# Altium schematic sheet Sheet5.SchDoc
size A4
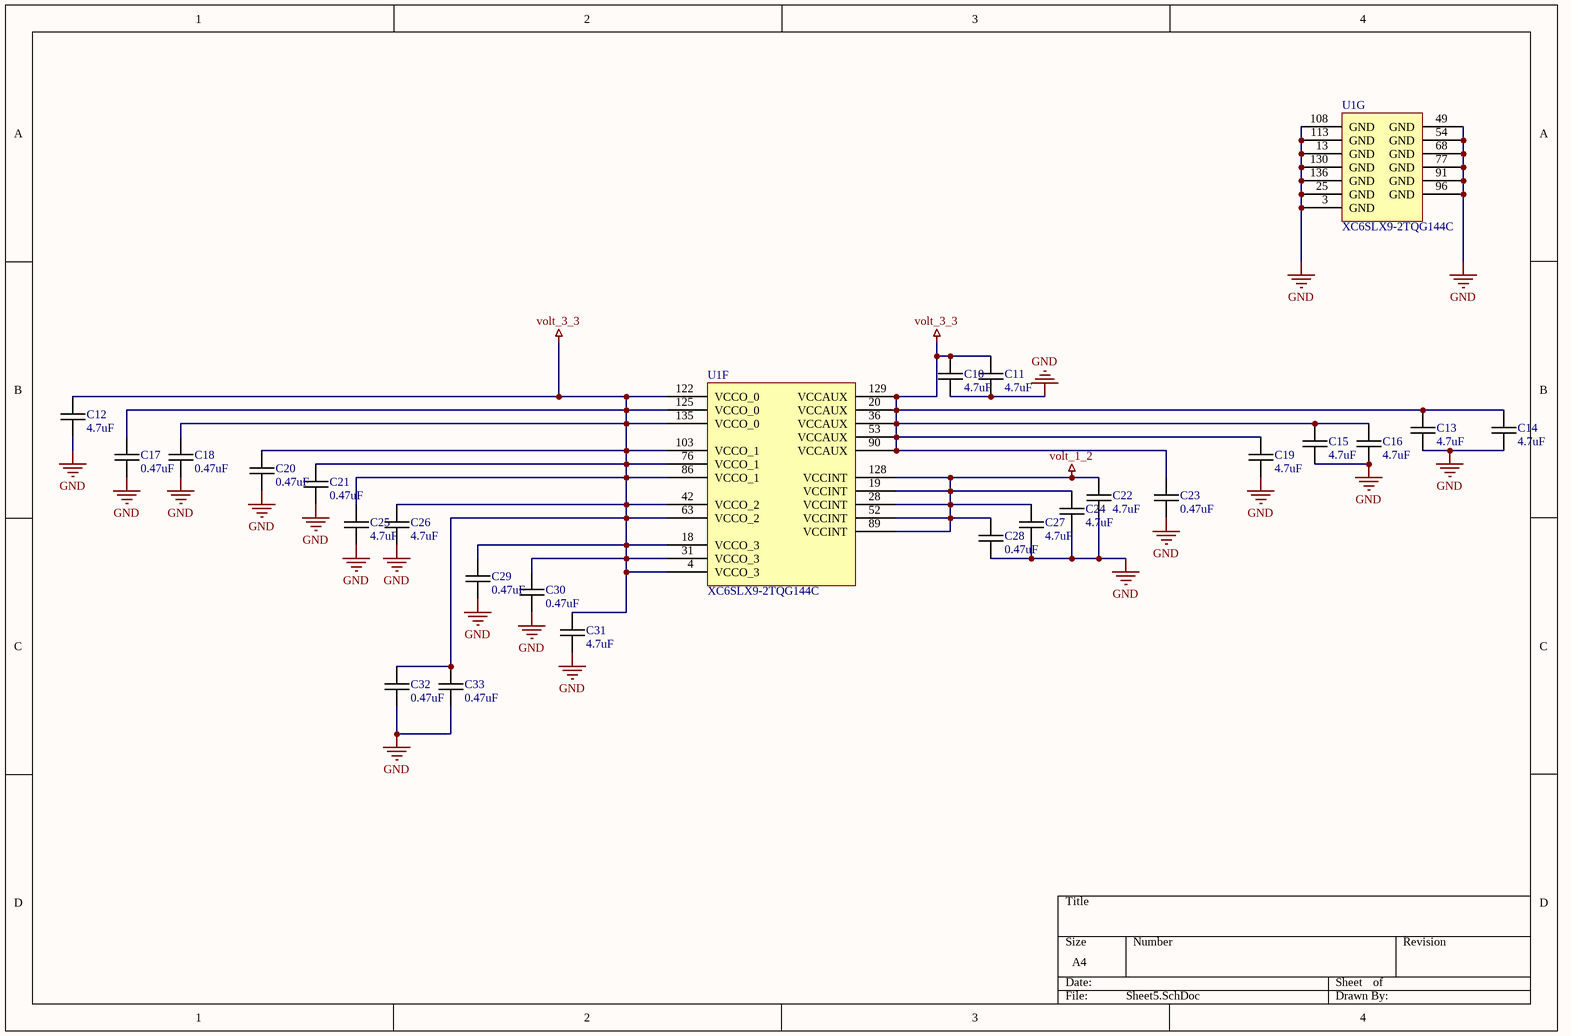
[diagram p0: Sheet5.SchDoc]

## Parts
C10  4.7uF  [0805C-GENERIC]
C11  4.7uF  [0805C-GENERIC]
C12  4.7uF  [0805C-GENERIC]
C13  4.7uF  [0805C-GENERIC]
C14  4.7uF  [0805C-GENERIC]
C15  4.7uF  [0805C-GENERIC]
C16  4.7uF  [0805C-GENERIC]
C17  0.47uF  [0805C-GENERIC]
C18  0.47uF  [0805C-GENERIC]
C19  4.7uF  [0805C-GENERIC]
C20  0.47uF  [0805C-GENERIC]
C21  0.47uF  [0805C-GENERIC]
C22  4.7uF  [0805C-GENERIC]
C23  0.47uF  [0805C-GENERIC]
C24  4.7uF  [0805C-GENERIC]
C25  4.7uF  [0805C-GENERIC]
C26  4.7uF  [0805C-GENERIC]
C27  4.7uF  [0805C-GENERIC]
C28  0.47uF  [0805C-GENERIC]
C29  0.47uF  [0805C-GENERIC]
C30  0.47uF  [0805C-GENERIC]
C31  4.7uF  [0805C-GENERIC]
C32  0.47uF  [0805C-GENERIC]
C33  0.47uF  [0805C-GENERIC]
U1  XC6SLX9-2TQG144C  [TQG144_N]  (parts F,G of 7)

## Nets
GND: C10.2 C11.2 C12.2 C13.2 C14.2 C15.2 C16.2 C17.2 C18.2 C19.2 C20.2 C21.2 C22.2 C23.2 C24.2 C25.2 C26.2 C27.2 C28.2 C29.2 C30.2 C31.2 C32.2 C33.2 U1.3(GND) U1.13(GND) U1.25(GND) U1.49(GND) U1.54(GND) U1.68(GND) U1.77(GND) U1.91(GND) U1.96(GND) U1.108(GND) U1.113(GND) U1.130(GND) U1.136(GND)
volt_1_2: C22.1 C24.1 C27.1 C28.1 U1.19(VCCINT) U1.28(VCCINT) U1.52(VCCINT) U1.89(VCCINT) U1.128(VCCINT)
volt_3_3: C10.1 C11.1 C12.1 C13.1 C14.1 C15.1 C16.1 C17.1 C18.1 C19.1 C20.1 C21.1 C23.1 C25.1 C26.1 C29.1 C30.1 C31.1 C32.1 C33.1 U1.4(VCCO_3) U1.18(VCCO_3) U1.20(VCCAUX) U1.31(VCCO_3) U1.36(VCCAUX) U1.42(VCCO_2) U1.53(VCCAUX) U1.63(VCCO_2) U1.76(VCCO_1) U1.86(VCCO_1) U1.90(VCCAUX) U1.103(VCCO_1) U1.122(VCCO_0) U1.125(VCCO_0) U1.129(VCCAUX) U1.135(VCCO_0)

## Library data of the parts
C10-C33 = 0805C-4U7-25V-X5R-TDK: CAPACITOR 0805 CERAMIC; Manufacturer: TDK Corporation; Manufacturer Part Number: C2012X5R1E475K; Tolerance: ±10%; Voltage - Rated: 25V; Temperature Coefficient: X5R; Capacitance: 4.7µF; REEL: C102; Supplier 1: Digi-Key; Supplier Part Number 1: 445-4116-1-ND; Packaging: Cut Tape (CT); Operating Temperature: -55°C ~ 85°C; Supplier: Digi-Key; Thickness: 1.25mm; RoHS: RoHS Compliant; Features: General Purpose; Mounting Type: Surface Mount, MLCC; Package / Case: 0805 (2012 Metric); Lead Spacing: -; Category: Capacitors; Supplier Part Number: 445-4116-1-ND
U1 = XC6SLX9-2TQG144C: Spartan-6 LX 1.2V FPGA, 102 User I/Os, 144-Pin TQFP (0.5mm Pitch), Speed Grade 2, Commercial Grade, Pb-Free; DatasheetVersion: ver1.6, Nov-2010; PackageVersion: ver1.2, Jun-2004; PackageReference: TQG144; PackageDescription: 144-Pin Thin Quad Flat Pack (TQG144) - Pb-Free; Code_JEDEC: MS-026-BFB; ComponentLink1Description: Manufacturer URL; ComponentLink1URL: http://www.xilinx.com/; ComponentLink2Description: Spartan-6 Datasheet; ComponentLink2URL: http://www.xilinx.com/support/documentation/data_sheets/ds160.pdf; ComponentLink3Description: Spartan-6 Documents; ComponentLink3URL: http://www.xilinx.com/support/documentation/spartan-6.htm